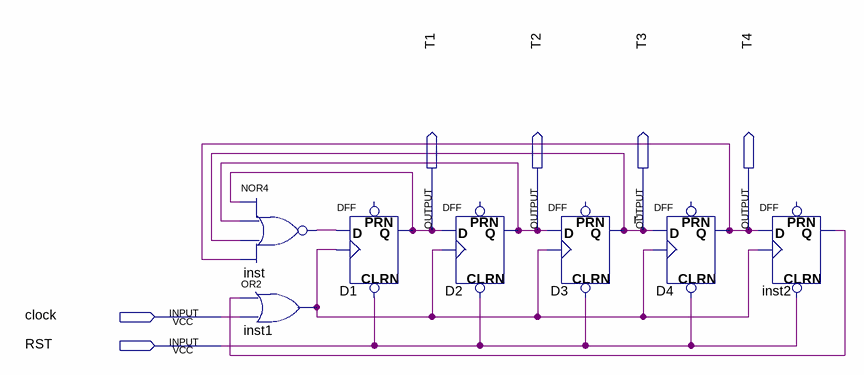
[diagram p0: schematic sheet]
// Quartus schematic experiment11.bdf as structural Verilog: 7 symbols, 6 pins
module experiment11 (
  input  clock,
  input  RST,
  output T1,
  output T2,
  output T3,
  output T4
);

  wire inst1_out, inst2_q, inst_out;

  nor inst (inst_out, T1, T2, T3, T4);
  or inst1 (inst1_out, inst2_q, clock);
  DFF D1 (.CLRN(RST), .CLK(inst1_out), .D(inst_out), .Q(T1));  // open: PRN
  DFF D2 (.CLRN(RST), .CLK(inst1_out), .D(T1), .Q(T2));  // open: PRN
  DFF D3 (.CLRN(RST), .CLK(inst1_out), .D(T2), .Q(T3));  // open: PRN
  DFF D4 (.CLRN(RST), .CLK(inst1_out), .D(T3), .Q(T4));  // open: PRN
  DFF inst2 (.CLRN(RST), .CLK(inst1_out), .D(T4), .Q(inst2_q));  // open: PRN

  // Other names for the same wires on the sheet: r = T3
endmodule
